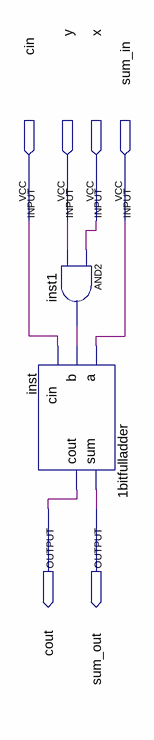
[diagram p0: schematic sheet]
// Quartus schematic cas.bdf as structural Verilog: 2 symbols, 6 pins
module cas (
  input  cin,
  input  y,
  input  x,
  input  sum_in,
  output cout,
  output sum_out
);

  wire inst1_out;

  and inst1 (inst1_out, x, y);
  \1bitfulladder  inst (.a(sum_in), .b(inst1_out), .cin(cin), .sum(sum_out), .cout(cout));
endmodule
